# Altium schematic sheet LowSpeedSlots_x8.SchDoc: 8-Channel Low-Speed Slots for DA-Card
size A4; DocumentNumber: 6; SheetNumber: 6; SheetTotal: 16
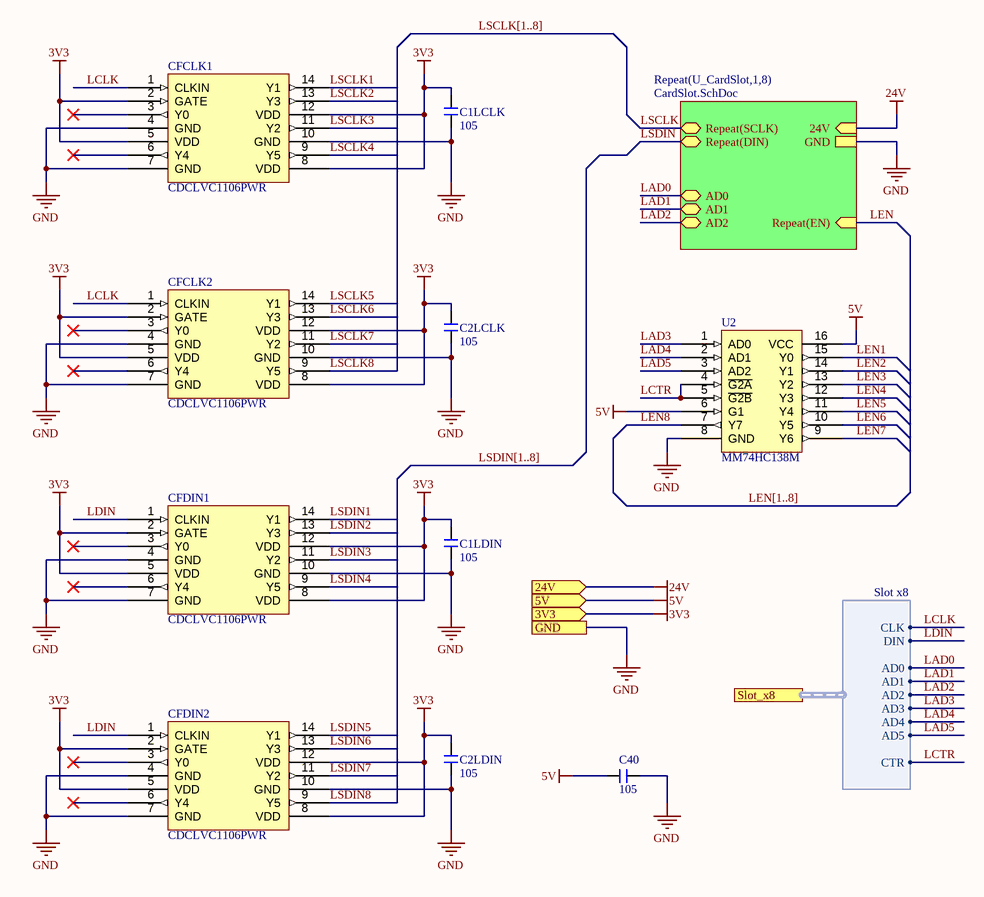
[diagram p0: LowSpeedSlots_x8.SchDoc]

## Parts
C1LCLK  105  [C 0603_L]
C1LDIN  105  [C 0603_L]
C2LCLK  105  [C 0603_L]
C2LDIN  105  [C 0603_L]
C40  105  [C 0603_L]
CFCLK1  CDCLVC1106PWR  [TSSOP14_L]
CFCLK2  CDCLVC1106PWR  [TSSOP14_L]
CFDIN1  CDCLVC1106PWR  [TSSOP14_L]
CFDIN2  CDCLVC1106PWR  [TSSOP14_L]
U2  MM74HC138M  [SO16NB]

## Sub-sheets
Repeat(U_CardSlot,1,8) = CardSlot.SchDoc: 24V (in), GND, Repeat(SCLK) (bidir), Repeat(DIN) (bidir), AD0 (bidir), AD1 (bidir), AD2 (bidir), Repeat(EN) (in)

## Ports
3V3 (in), 5V (in), 24V (in), GND, Slot_x8 (harness Slot x8)

## Harnesses
Slot x8: CLK, DIN, AD0, AD1, AD2, AD3, AD4, AD5, CTR

## Nets
3V3: C1LCLK.2 C1LDIN.2 C2LCLK.2 C2LDIN.2 CFCLK1.2(GATE) CFCLK1.5(VDD) CFCLK1.8(VDD) CFCLK1.12(VDD) CFCLK2.2(GATE) CFCLK2.5(VDD) CFCLK2.8(VDD) CFCLK2.12(VDD) CFDIN1.2(GATE) CFDIN1.5(VDD) CFDIN1.8(VDD) CFDIN1.12(VDD) CFDIN2.2(GATE) CFDIN2.5(VDD) CFDIN2.8(VDD) CFDIN2.12(VDD) ; port 3V3
5V: C40.2 U2.6(G1) U2.16(VCC) ; port 5V
24V: port 24V, sheet Repeat(U_CardSlot,1,8)/24V
GND: C1LCLK.1 C1LDIN.1 C2LCLK.1 C2LDIN.1 C40.1 CFCLK1.4(GND) CFCLK1.7(GND) CFCLK1.10(GND) CFCLK2.4(GND) CFCLK2.7(GND) CFCLK2.10(GND) CFDIN1.4(GND) CFDIN1.7(GND) CFDIN1.10(GND) CFDIN2.4(GND) CFDIN2.7(GND) CFDIN2.10(GND) U2.8(GND) ; port GND, sheet Repeat(U_CardSlot,1,8)/GND
LAD0: sheet Repeat(U_CardSlot,1,8)/AD0, port Slot_x8.AD0
LAD1: sheet Repeat(U_CardSlot,1,8)/AD1, port Slot_x8.AD1
LAD2: sheet Repeat(U_CardSlot,1,8)/AD2, port Slot_x8.AD2
LAD3: U2.1(AD0) ; port Slot_x8.AD3
LAD4: U2.2(AD1) ; port Slot_x8.AD4
LAD5: U2.3(AD2) ; port Slot_x8.AD5
LCLK: CFCLK1.1(CLKIN) CFCLK2.1(CLKIN) ; port Slot_x8.CLK
LCTR: U2.4(~{G2A}) U2.5(~{G2B}) ; port Slot_x8.CTR
LDIN: CFDIN1.1(CLKIN) CFDIN2.1(CLKIN) ; port Slot_x8.DIN
LEN: sheet Repeat(U_CardSlot,1,8)/Repeat(EN)
LEN1: U2.15(Y0)
LEN2: U2.14(Y1)
LEN3: U2.13(Y2)
LEN4: U2.12(Y3)
LEN5: U2.11(Y4)
LEN6: U2.10(Y5)
LEN7: U2.9(Y6)
LEN8: U2.7(Y7)
LSCLK: sheet Repeat(U_CardSlot,1,8)/Repeat(SCLK)
LSCLK1: CFCLK1.14(Y1)
LSCLK2: CFCLK1.13(Y3)
LSCLK3: CFCLK1.11(Y2)
LSCLK4: CFCLK1.9(Y5)
LSCLK5: CFCLK2.14(Y1)
LSCLK6: CFCLK2.13(Y3)
LSCLK7: CFCLK2.11(Y2)
LSCLK8: CFCLK2.9(Y5)
LSDIN: sheet Repeat(U_CardSlot,1,8)/Repeat(DIN)
LSDIN1: CFDIN1.14(Y1)
LSDIN2: CFDIN1.13(Y3)
LSDIN3: CFDIN1.11(Y2)
LSDIN4: CFDIN1.9(Y5)
LSDIN5: CFDIN2.14(Y1)
LSDIN6: CFDIN2.13(Y3)
LSDIN7: CFDIN2.11(Y2)
LSDIN8: CFDIN2.9(Y5)

Not connected (* = marked no-connect by the designer): CFCLK1 3(Y0)* 6(Y4)*; CFCLK2 3(Y0)* 6(Y4)*; CFDIN1 3(Y0)* 6(Y4)*; CFDIN2 3(Y0)* 6(Y4)*

## Buses and harness runs
bus LEN[1..8]
bus LSCLK[1..8]
bus LSDIN[1..8]

## Notes on the sheet
- Title
- FileName:
- Version:
- Date:
- Project
- Designed By:
- Descriptions:
- Sheet:
- of

## Library data of the parts
C1LCLK C1LDIN C2LCLK C2LDIN C40 = C: 贴片电容; BOM名称: 无极性贴片电容; 淘宝ID: 封装库来自淘宝 ID：黄晶宝石; 联系售后，技术支持: https://shop463601444.taobao.com; 唯一出售店铺网址: https://shop463601444.taobao.com
CFCLK1 CFCLK2 CFDIN1 CFDIN2 = CDCLVC1106PWR: 1:6 Clock Fan-out Buffer
U2 = MM74HC138M: 3-to-8 Decoder